# Altium schematic sheet 21.SchDoc
size 513 x 386 mm
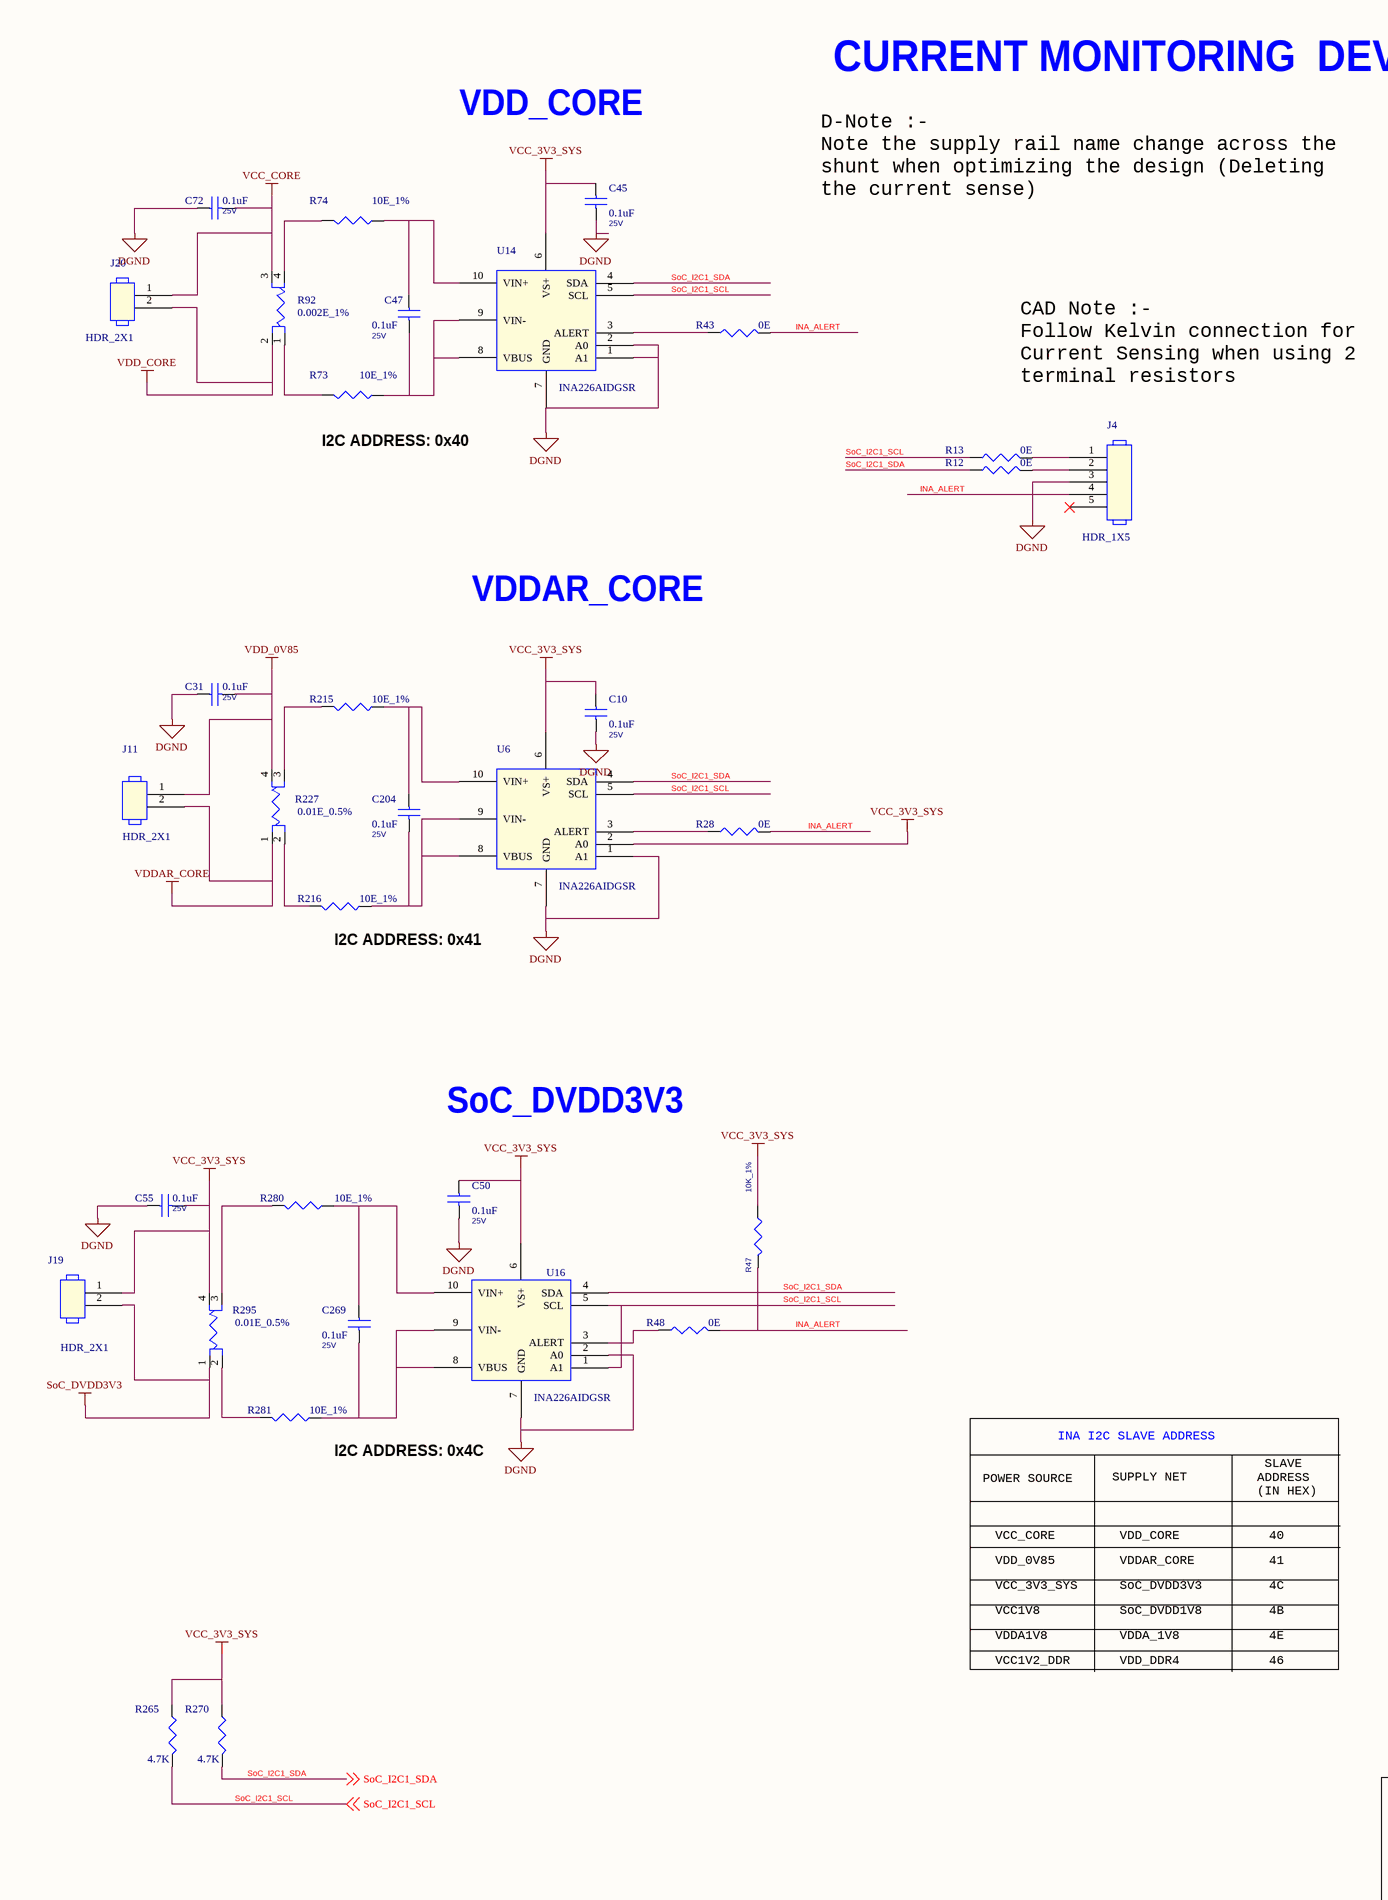
[diagram p0: 21.SchDoc, left]
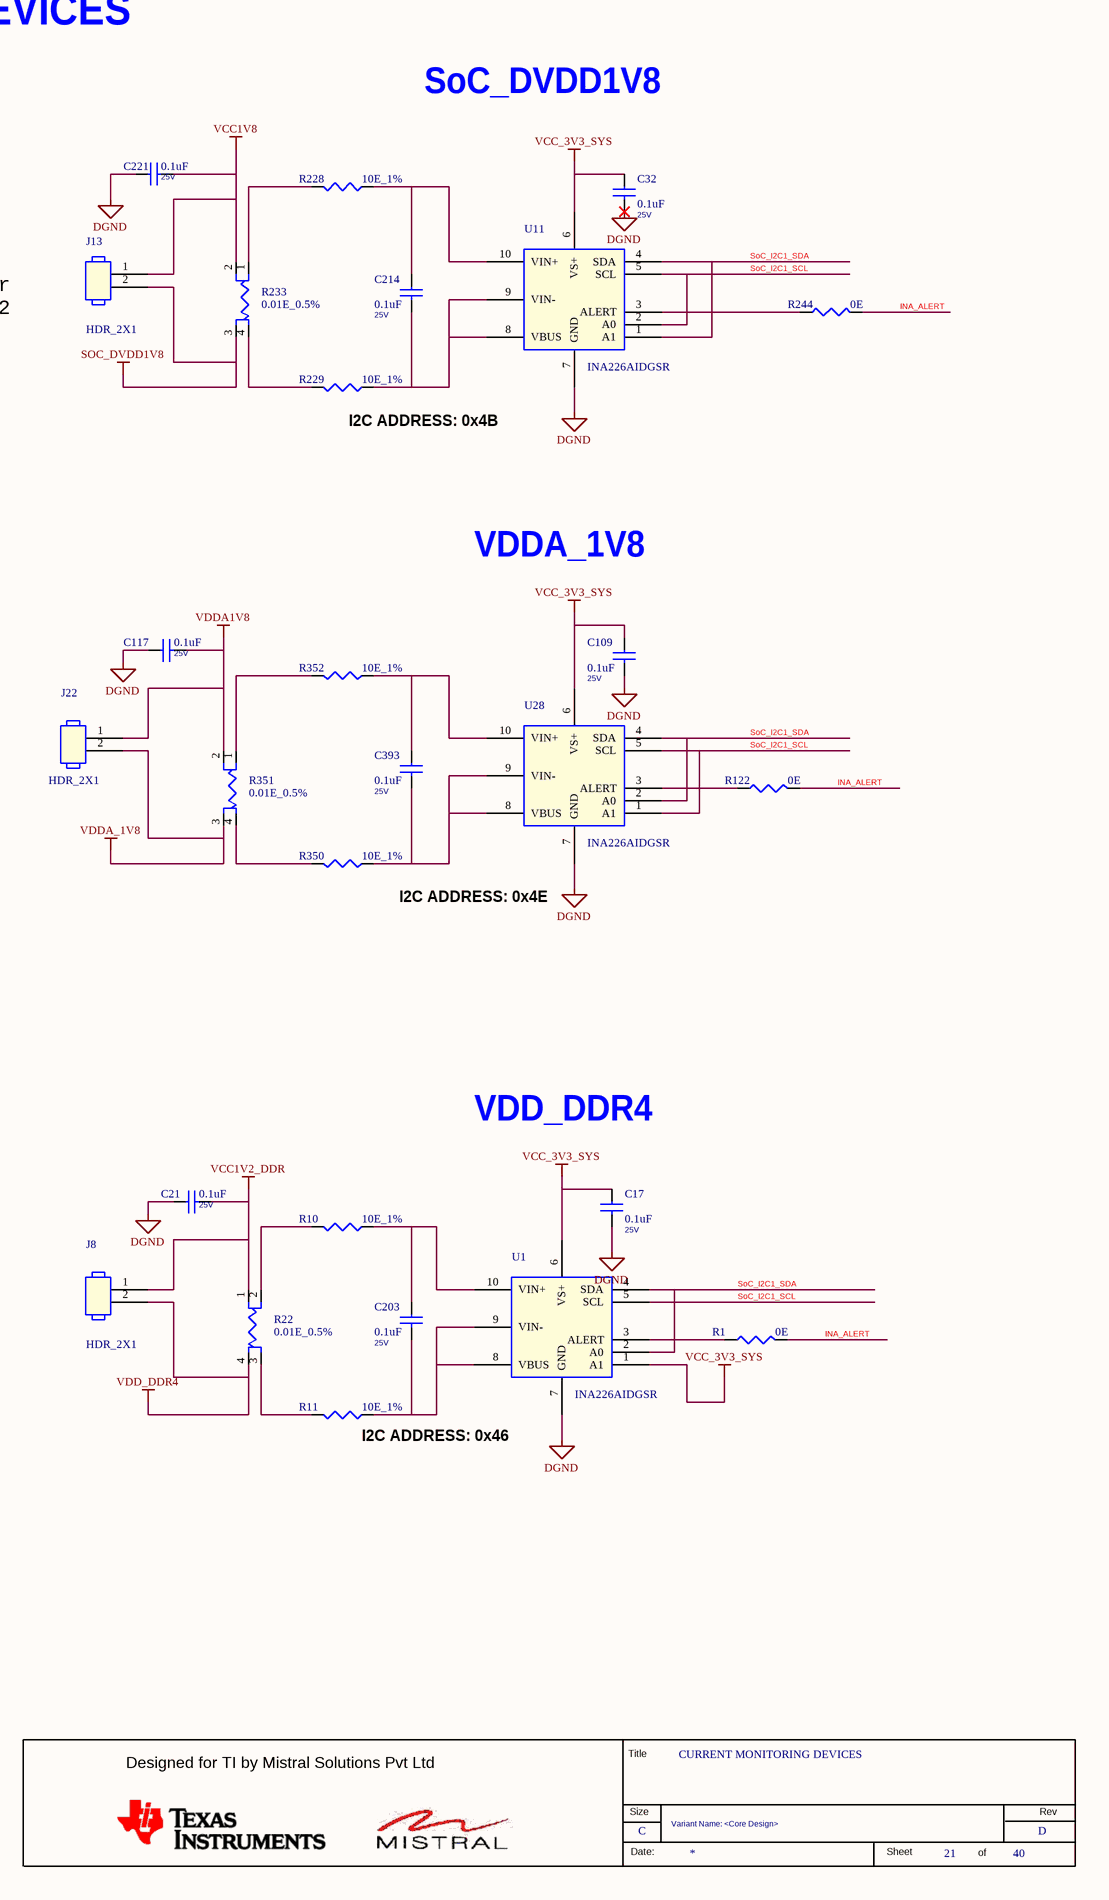
[diagram p1: 21.SchDoc, right]

## Parts
*  RevCode: D  Title: CURRENT MONITORING DEVICES  Page Size: C  Page Number: 21  Page Count: 40  Variant Name: <Core Design>  (hidden comment: MISTRAL_TITLEBLK_CSIZE)  (graphical)
C10  0.1uF  Voltage: 25V  [CAP0402_0-75]
C17  0.1uF  Voltage: 25V  [CAP0402_0-75]
C21  0.1uF  Voltage: 25V  [CAP0402_0-75]
C31  0.1uF  Voltage: 25V  [CAP0402_0-75]
C32  0.1uF  Voltage: 25V  [CAP0402_0-75]
C45  0.1uF  Voltage: 25V  [CAP0402_0-75]
C47  0.1uF  Voltage: 25V  [CAP0402_0-75]
C50  0.1uF  Voltage: 25V  [CAP0402_0-75]
C55  0.1uF  Voltage: 25V  [CAP0402_0-75]
C72  0.1uF  Voltage: 25V  [CAP0402_0-75]
C109  0.1uF  Voltage: 25V  [CAP0402_0-75]
C117  0.1uF  Voltage: 25V  [CAP0402_0-75]
C203  0.1uF  Voltage: 25V  [CAP0402_0-75]
C204  0.1uF  Voltage: 25V  [CAP0402_0-75]
C214  0.1uF  Voltage: 25V  [CAP0402_0-75]
C221  0.1uF  Voltage: 25V  [CAP0402_0-75]
C269  0.1uF  Voltage: 25V  [CAP0402_0-75]
C393  0.1uF  Voltage: 25V  [CAP0402_0-75]
J4  HDR_1X5  [HDR_5X1_100_S_T_11-2]
J8  HDR_2X1  [HDR_2X1_100_S_T_10-8]
J11  HDR_2X1  [HDR_2X1_100_S_T_10-8]
J13  HDR_2X1  [HDR_2X1_100_S_T_10-8]
J19  HDR_2X1  [HDR_2X1_100_S_T_10-8]
J20  HDR_2X1  [HDR_2X1_100_S_T_10-8]
J22  HDR_2X1  [HDR_2X1_100_S_T_10-8]
R1  0E  [RES0402_0-5]
R10  10E_1%  [RES0402_0-5]
R11  10E_1%  [RES0402_0-5]
R12  0E  [RES0402_0-5]
R13  0E  [RES0402_0-5]
R22  0.01E_0.5%  [RES1206-4TERM_0-75]
R28  0E  [RES0402_0-5]
R43  0E  [RES0402_0-5]
R47  10K_1%  [RES0402N]
R48  0E  [RES0402_0-5]
R73  10E_1%  [RES0402_0-5]
R74  10E_1%  [RES0402_0-5]
R92  0.002E_1%  [RES2512-4TERM_0-75]
R122  0E  [RES0402_0-5]
R215  10E_1%  [RES0402_0-5]
R216  10E_1%  [RES0402_0-5]
R227  0.01E_0.5%  [RES1206-4TERM_0-75]
R228  10E_1%  [RES0402_0-5]
R229  10E_1%  [RES0402_0-5]
R233  0.01E_0.5%  [RES1206-4TERM_0-75]
R244  0E  [RES0402_0-5]
R265  4.7K  [RES0402_0-5]
R270  4.7K  [RES0402_0-5]
R280  10E_1%  [RES0402_0-5]
R281  10E_1%  [RES0402_0-5]
R295  0.01E_0.5%  [RES1206-4TERM_0-75]
R350  10E_1%  [RES0402_0-5]
R351  0.01E_0.5%  [RES1206-4TERM_0-75]
R352  10E_1%  [RES0402_0-5]
U1  INA226AIDGSR  [MSOP10_19-68_120X120_1-1]
U6  INA226AIDGSR  [MSOP10_19-68_120X120_1-1]
U11  INA226AIDGSR  [MSOP10_19-68_120X120_1-1]
U14  INA226AIDGSR  [MSOP10_19-68_120X120_1-1]
U16  INA226AIDGSR  [MSOP10_19-68_120X120_1-1]
U28  INA226AIDGSR  [MSOP10_19-68_120X120_1-1]

## Nets
DGND: C10.2 C17.2 C21.1 C31.1 C32.2 C45.2 C50.2 C55.1 C72.1 C109.2 C117.1 C221.1 J4.3 U1.7(GND) U6.1(A1) U6.7(GND) U11.7(GND) U14.1(A1) U14.2(A0) U14.7(GND) U16.2(A0) U16.7(GND) U28.7(GND)
SOC_DVDD1V8: J13.2 R233.3
SoC_DVDD3V3: J19.2 R295.1
VCC1V2_DDR: C21.2 J8.1 R22.1
VCC1V8: C221.2 J13.1 R233.2
VCC_3V3_SYS: C10.1 C17.1 C32.1 C45.1 C50.1 C55.2 C109.1 J19.1 R47.2 R265.1 R270.1 R295.4 U1.1(A1) U1.6(VS+) U6.2(A0) U6.6(VS+) U11.6(VS+) U14.6(VS+) U16.6(VS+) U28.6(VS+)
VCC_CORE: C72.2 J20.1 R92.3
VDD_0V85: C31.2 J11.1 R227.4
VDD_CORE: J20.2 R92.2
VDD_DDR4: J8.2 R22.4
VDDA1V8: C117.2 J22.1 R351.2
VDDA_1V8: J22.2 R351.3
VDDAR_CORE: J11.2 R227.1
INA_ALERT: J4.4 R1.2 R28.2 R43.2 R47.1 R48.2 R122.2 R244.2
SoC_I2C1_SCL: R13.1 R265.2 U1.5(SCL) U6.5(SCL) U11.2(A0) U11.5(SCL) U14.5(SCL) U16.1(A1) U16.5(SCL) U28.1(A1) U28.5(SCL) ; off-sheet SoC_I2C1_SCL
SoC_I2C1_SDA: R12.1 R270.2 U1.2(A0) U1.4(SDA) U6.4(SDA) U11.1(A1) U11.4(SDA) U14.4(SDA) U16.4(SDA) U28.2(A0) U28.4(SDA) ; off-sheet SoC_I2C1_SDA
NetC47_1: C47.1 R74.1 U14.10(VIN+)
NetC47_2: C47.2 R73.1 U14.8(VBUS) U14.9(VIN-)
NetC203_1: C203.1 R10.1 U1.10(VIN+)
NetC203_2: C203.2 R11.1 U1.8(VBUS) U1.9(VIN-)
NetC204_1: C204.1 R215.1 U6.10(VIN+)
NetC204_2: C204.2 R216.1 U6.8(VBUS) U6.9(VIN-)
NetC214_1: C214.1 R228.1 U11.10(VIN+)
NetC214_2: C214.2 R229.1 U11.8(VBUS) U11.9(VIN-)
NetC269_1: C269.1 R280.1 U16.10(VIN+)
NetC269_2: C269.2 R281.1 U16.8(VBUS) U16.9(VIN-)
NetC393_1: C393.1 R352.1 U28.10(VIN+)
NetC393_2: C393.2 R350.1 U28.8(VBUS) U28.9(VIN-)
NetJ4_1: J4.1 R13.2
NetJ4_2: J4.2 R12.2
NetR1_1: R1.1 U1.3(ALERT)
NetR10_2: R10.2 R22.2
NetR11_2: R11.2 R22.3
NetR28_1: R28.1 U6.3(ALERT)
NetR43_1: R43.1 U14.3(ALERT)
NetR48_1: R48.1 U16.3(ALERT)
NetR73_2: R73.2 R92.1
NetR74_2: R74.2 R92.4
NetR122_1: R122.1 U28.3(ALERT)
NetR215_2: R215.2 R227.3
NetR216_2: R216.2 R227.2
NetR228_2: R228.2 R233.1
NetR229_2: R229.2 R233.4
NetR244_1: R244.1 U11.3(ALERT)
NetR280_2: R280.2 R295.3
NetR281_2: R281.2 R295.2
NetR350_2: R350.2 R351.4
NetR351_1: R351.1 R352.2

Not connected (* = marked no-connect by the designer): J4 5*

## Notes on the sheet
- VDD_CORE
- D-Note :-
  Note the supply rail name change across the
  shunt when optimizing the design (Deleting
  the current sense)
- CURRENT MONITORING  DEVICES
- SoC_DVDD1V8
- CAD Note :-
  Follow Kelvin connection for
  Current Sensing when using 2
  terminal resistors
- (near R73) I2C ADDRESS: 0x40
- (near R229) I2C ADDRESS: 0x4B
- VDDAR_CORE
- VDDA_1V8
- (near R216) I2C ADDRESS: 0x41
- I2C ADDRESS: 0x4E
- SoC_DVDD3V3
- VDD_DDR4
- INA I2C SLAVE ADDRESS
- (near R281) I2C ADDRESS: 0x4C
- POWER SOURCE
- SUPPLY NET
- SLAVE
  ADDRESS
  (IN HEX)
- (near R11) I2C ADDRESS: 0x46
- VCC_CORE
- VDD_0V85
- 40
- 41
- VCC_3V3_SYS
- VCC1V8
- 4C
- 4B
- VDDA1V8
- VCC1V2_DDR
- 4E
- 46
- (in symbol MISTRAL_TITLEBLK_CSIZE) Title; Designed for TI by Mistral Solutions Pvt Ltd; Size; Rev; Date:; Sheet; of

## Library data of the parts
* = MISTRAL_TITLEBLK_CSIZE: Issue: 1.0; Page Create Date: March  8, 1995; Page Modify Date: *
C10 C17 C21 C31 C55 C72 C117 C203 C204 C269 C393 = CAP_Dup3: CAP CERAMIC 0.1uF 25V 20% X5R 0402; Alt_Mfr_name: YAGEO AMERICA; Part_type: CAPACITORS\CERAMIC; Mfr_part_number: 885012105018; Mfr_name: WURTH ELECTRONICS; Mistral Part No: 120020080003-R; Alt_Mfr_part_number: CC0402KRX5R8BB104; Custom_Duty: 15%; Customs_HS_Code: 85322990; Wattage: NA; Project: AM64x_EVM_BRD; PCB Footprint: CAP0402_0-75; Footprint Path: Y:\MIS_DATABASE\Library\ALTIUM_TOOL\PCB_FOOTPRINTS\Altium_Footprint_Lib.PcbLib; Library Path: Y:\MIS_DATABASE\Library\ALTIUM_TOOL\SCHEMATICS_PARTS\MS_DISCRETE_Library.schlib; Footprint Ref: CAP0402_0-75; Library Ref: CAP; MECHANICAL 3D STEP FILE: CAP0402_0-75; Chkd/date: MANIRAJA/170820; Crtd /date: ALVY/170820; Datasheet: Y:\MIS_DATABASE\DATASHEETS\CAPACITORS\885012105018.PDF; Temperature: -55癈+85癈; Weight: 0.65mg; Height: 0.55MM; Distributor_part_number: 732-7495-1-ND; Distributor_name: DIGIKEY; Package: 0402; Tolerance: 20%
C32 C45 C47 C50 C109 C214 C221 = CAP_Dup3: CAP CERAMIC 0.1uF 25V 20% X5R 0402; Alt_Mfr_part_number: CC0402KRX5R8BB104; Mistral Part No: 120020080003-R; Mfr_name: WURTH ELECTRONICS; Mfr_part_number: 885012105018; Part_type: CAPACITORS\CERAMIC; Alt_Mfr_name: YAGEO AMERICA; Project: AM64x_EVM_BRD; Wattage: NA; Customs_HS_Code: 85322990; Custom_Duty: 15%; PCB Footprint: CAP0402_0-75; Tolerance: 20%; Package: 0402; Distributor_name: DIGIKEY; Distributor_part_number: 732-7495-1-ND; Height: 0.55MM; Weight: 0.65mg; Temperature: -55癈+85癈; Datasheet: Y:\MIS_DATABASE\DATASHEETS\CAPACITORS\885012105018.PDF; Crtd /date: ALVY/170820; Chkd/date: MANIRAJA/170820; MECHANICAL 3D STEP FILE: CAP0402_0-75; Library Ref: CAP; Footprint Ref: CAP0402_0-75; Library Path: Y:\MIS_DATABASE\Library\ALTIUM_TOOL\SCHEMATICS_PARTS\MS_DISCRETE_Library.schlib; Footprint Path: Y:\MIS_DATABASE\Library\ALTIUM_TOOL\PCB_FOOTPRINTS\Altium_Footprint_Lib.PcbLib
J4 = HEADER_5X1: CON HDR 1X5 2.54MM PITCH ST TH; Mistral Part No: 150009030262-R; Mfr_name: MOLEX; Part_type: CONNECTOR\HEADERS; Wattage: NA; Project: HSWD; Customs_HS_Code: 85369090; Custom_Duty: 24%; MECHANICAL 3D STEP FILE: HDR_5X1_100_S_T_11-2; Temperature: NA; Weight: 343mg; Voltage: NA; Tolerance: NA; Mfr_part_number: 22-03-2051; Package: THRU-HOLE; Distributor_name: DIGIKEY; Distributor_part_number: WM4003-ND; Height: 11.17MM; Datasheet: Y:\MIS_DATABASE\DATASHEETS\CONNECTORS\MOLEX022032021.PDF; Crtd /date: MAZHAR/280405; Chkd/date: VASANTHA/310117; Library Ref: HEADER_5X1; Library Path: Y:\MIS_DATABASE\Library\ALTIUM_TOOL\SCHEMATICS_PARTS\MS_CONNECTOR_Library.schlib; Footprint Path: Y:\MIS_DATABASE\Library\ALTIUM_TOOL\PCB_FOOTPRINTS\Altium_Footprint_Lib.PcbLib; PCB Footprint: HDR_5X1_100_S_T_11-2
J8 J11 J13 J19 J20 J22 = HEADER_2X1_Dup1: CON HDR 2X1 2.54MM PITCH ST TH; Mistral Part No: 150009030246-R; Mfr_name: MOLEX; Part_type: CONNECTOR\HEADERS; Wattage: NA; Project: FPGA EXTENDER CARD; Customs_HS_Code: 85369090; Custom_Duty: 24%; Footprint Path: Y:\MIS_DATABASE\Library\ALTIUM_TOOL\PCB_FOOTPRINTS\Altium_Footprint_Lib.PcbLib; Library Path: Y:\MIS_DATABASE\Library\ALTIUM_TOOL\SCHEMATICS_PARTS\MS_Connector_Library.schlib; MECHANICAL 3D STEP FILE: HDR_2X1_100_S_T_10-8; Temperature: -0癈+75癈; Weight: 139gm; Voltage: NA; Tolerance: NA; Mfr_part_number: 22-03-2021; Package: THRU-HOLE; Distributor_name: DIGIKEY; Distributor_part_number: WM4000-ND; Height: 10.79MM; Datasheet: Y:\MIS_DATABASE\DATASHEETS\CONNECTORS\HEADER_X4030.PDF; Crtd /date: MAZHAR/280405; Chkd/date: VASANTHA/060117; Library Ref: HEADER_2X1; Footprint Ref: HDR_2X1_100_S_T_10-8; PCB Footprint: HDR_2X1_100_S_T_10-8
R1 R12 R28 R43 R244 = RESISTOR_Dup5: RES 0E 1/16W JUMPER 0402; Part_type: RESISTORS\FIXED; Mfr_part_number: CRCW04020000Z0ED; Mfr_name: VISHAY; Mistral Part No: 110010080019-R; Custom_Duty: 15%; Customs_HS_Code: 85332119; Voltage: NA; Project: PB_BUGBASE; Footprint Path: Y:\MIS_DATABASE\Library\ALTIUM_TOOL\PCB_FOOTPRINTS\Altium_Footprint_Lib.PcbLib; Library Path: Y:\MIS_DATABASE\Library\ALTIUM_TOOL\SCHEMATICS_PARTS\MS_DISCRETE_Library.schlib; Footprint Ref: RES0402_0-5; Library Ref: RESISTOR; Chkd/date: VASANTHA/201216; Crtd /date: MUDDU/190810; Datasheet: Y:\MIS_DATABASE\DATASHEETS\RESISTORS\CRCW0603.PDF; Temperature: -55癈+155癈; Weight: 0.65mg; Height: 0.40MM; Distributor_part_number: 541-0.0JCT-ND; Distributor_name: DIGIKEY; Package: 0402; Wattage: 1/16W; Tolerance: NA; MECHANICAL 3D STEP FILE: RES0402_0-5; PCB Footprint: RES0402_0-5
R10 R11 R73 R216 R281 R350 R352 = RESISTOR_Dup6: RES 10E 1/16W 1% 0402; Part_type: RESISTORS\FIXED; Mfr_part_number: RC0402FR-0710RL; Mfr_name: YAGEO AMERICA; Mistral Part No: 110018020004-R; Custom_Duty: 15%; Customs_HS_Code: 85332119; Voltage: NA; Project: TI_MAXIE_CPB; MECHANICAL 3D STEP FILE: RES0402_0-5; Chkd/date: MANIRAJA/070218; Crtd /date: ALVY/070218; Datasheet: Y:\MIS_DATABASE\DATASHEETS\RESISTORS\RCXXXXL-SER_MAR18.PDF; Temperature: -55癈+155癈; Weight: 0.65mg; Height: 0.40MM; Distributor_part_number: 311-10.0LRCT-ND; Distributor_name: DIGIKEY; Package: 0402; Wattage: 1/16W; Tolerance: 1%; Library Ref: RESISTOR; Footprint Ref: RES0402_0-5; Library Path: Y:\MIS_DATABASE\Library\ALTIUM_TOOL\SCHEMATICS_PARTS\MS_DISCRETE_Library.schlib; Footprint Path: Y:\MIS_DATABASE\Library\ALTIUM_TOOL\PCB_FOOTPRINTS\Altium_Footprint_Lib.PcbLib; PCB Footprint: RES0402_0-5
R13 R48 R122 = RESISTOR_Dup5: RES 0E 1/16W JUMPER 0402; Mistral Part No: 110010080019-R; Mfr_name: VISHAY; Mfr_part_number: CRCW04020000Z0ED; Part_type: RESISTORS\FIXED; Project: PB_BUGBASE; Tolerance: NA; Customs_HS_Code: 85332119; Custom_Duty: 15%; MECHANICAL 3D STEP FILE: RES0402_0-5; Voltage: NA; Wattage: 1/16W; Package: 0402; Distributor_name: DIGIKEY; Distributor_part_number: 541-0.0JCT-ND; Height: 0.40MM; Weight: 0.65mg; Temperature: -55癈+155癈; Datasheet: Y:\MIS_DATABASE\DATASHEETS\RESISTORS\CRCW0603.PDF; Crtd /date: MUDDU/190810; Chkd/date: VASANTHA/201216; Library Ref: RESISTOR; Footprint Ref: RES0402_0-5; Library Path: Y:\MIS_DATABASE\Library\ALTIUM_TOOL\SCHEMATICS_PARTS\MS_DISCRETE_Library.schlib; Footprint Path: Y:\MIS_DATABASE\Library\ALTIUM_TOOL\PCB_FOOTPRINTS\Altium_Footprint_Lib.PcbLib; PCB Footprint: RES0402_0-5
R22 R233 R351 = RESISTOR-4TERM: RES 0.01E 1/2W 0.5% 1206-4; Part_type: RESISTORS\FIXED; Mfr_part_number: LVK12R010DER; Mfr_name: OHMITE; Mistral Part No: 110017090009-R; Custom_Duty: 15%; Customs_HS_Code: 85332119; Voltage: NA; Project: TI_MAXIE_CPB; PCB Footprint: RES1206-4TERM_0-75; Footprint Path: Y:\MIS_DATABASE\Library\ALTIUM_TOOL\PCB_FOOTPRINTS\Altium_Footprint_Lib.PcbLib; Library Path: Y:\MIS_DATABASE\Library\ALTIUM_TOOL\SCHEMATICS_PARTS\MS_DISCRETE_Library.schlib; Footprint Ref: RES1206-4TERM_0-75; Library Ref: RESISTOR-4TERM; MECHANICAL 3D STEP FILE: RES1206-4TERM_0-75; Chkd/date: MANIRAJA/260917; Crtd /date: MANIRAJA/260917; Datasheet: Y:\MIS_DATABASE\DATASHEETS\RESISTORS\LVK-SERIES.PDF; Temperature: -40癈+125癈; Weight: 16.2mg; Height: 0.65MM; Distributor_part_number: LVK12R010DERCT-ND; Distributor_name: DIGIKEY; Package: 1206-4; Wattage: 1/2W; Tolerance: 0.5%
R47 = RESISTOR_Dup3: RES 10K 1/16W 1% 0402; Part_type: RESISTORS\FIXED; Mfr_part_number: RC0402FR-0710KL; Mfr_name: YAGEO AMERICA; Mistral Part No: 110015090015-R; MECHANICAL 3D STEP FILE: RES0402_0-5; Voltage: NA; Custom_Duty: 15%; Customs_HS_Code: 85332119; Project: VOCERA; Footprint Path: Y:\MIS_DATABASE\Library\ALTIUM_TOOL\PCB_FOOTPRINTS\Altium_Footprint_Lib.PcbLib; Library Path: Y:\MIS_DATABASE\Library\ALTIUM_TOOL\SCHEMATICS_PARTS\MS_DISCRETE_Library.schlib; Footprint Ref: RES0402_0-5; Library Ref: RESISTOR; Temperature: -55癈+155癈; Weight: 0.65mg; Chkd/date: VASANTHA/201216; Crtd /date: GEETHA/290506; Datasheet: Y:\MIS_DATABASE\DATASHEETS\RESISTORS\RCXXXXL-SER_MAR18.PDF; Height: 0.40MM; Distributor_part_number: 311-10.0KLRTR-ND; Distributor_name: DIGIKEY; Package: 0402; Wattage: 1/16W; Tolerance: 1%; PCB Footprint: RES0402_0-5
R74 R215 R228 R229 R280 = RESISTOR_Dup6: RES 10E 1/16W 1% 0402; Mistral Part No: 110018020004-R; Mfr_name: YAGEO AMERICA; Mfr_part_number: RC0402FR-0710RL; Part_type: RESISTORS\FIXED; Project: TI_MAXIE_CPB; Voltage: NA; Customs_HS_Code: 85332119; Custom_Duty: 15%; Tolerance: 1%; Wattage: 1/16W; Package: 0402; Distributor_name: DIGIKEY; Distributor_part_number: 311-10.0LRCT-ND; Height: 0.40MM; Weight: 0.65mg; Temperature: -55癈+155癈; Datasheet: Y:\MIS_DATABASE\DATASHEETS\RESISTORS\RCXXXXL-SER_MAR18.PDF; Crtd /date: ALVY/070218; Chkd/date: MANIRAJA/070218; MECHANICAL 3D STEP FILE: RES0402_0-5; Library Ref: RESISTOR; Footprint Ref: RES0402_0-5; Library Path: Y:\MIS_DATABASE\Library\ALTIUM_TOOL\SCHEMATICS_PARTS\MS_DISCRETE_Library.schlib; Footprint Path: Y:\MIS_DATABASE\Library\ALTIUM_TOOL\PCB_FOOTPRINTS\Altium_Footprint_Lib.PcbLib; PCB Footprint: RES0402_0-5
R92 = RESISTOR-4TERM: RES 0.002E 2W 1% 2512-4; Mistral Part No: 110017090010-R; Mfr_name: OHMITE; Mfr_part_number: LVK25R002FER; Part_type: RESISTORS\FIXED; Project: TI_MAXIE_CPB; Voltage: NA; Customs_HS_Code: 85332119; Custom_Duty: 15%; PCB Footprint: RES2512-4TERM_0-75; Tolerance: 1%; Wattage: 2W; Package: 2512-4; Distributor_name: DIGIKEY; Distributor_part_number: LVK25R002FERCT-ND; Height: 0.70MM; Weight: NA; Temperature: -40癈+125癈; Datasheet: Y:\MIS_DATABASE\DATASHEETS\RESISTORS\LVK-SERIES.PDF; Crtd /date: MANIRAJA/260917; Chkd/date: MANIRAJA/260917; MECHANICAL 3D STEP FILE: RES2512-4TERM_0-75; Library Ref: RESISTOR-4TERM; Footprint Ref: RES2512-4TERM_0-75; Library Path: Y:\MIS_DATABASE\Library\ALTIUM_TOOL\SCHEMATICS_PARTS\MS_DISCRETE_Library.schlib; Footprint Path: Y:\MIS_DATABASE\Library\ALTIUM_TOOL\PCB_FOOTPRINTS\Altium_Footprint_Lib.PcbLib
R227 R295 = RESISTOR-4TERM: RES 0.01E 1/2W 0.5% 1206-4; Mistral Part No: 110017090009-R; Mfr_name: OHMITE; Mfr_part_number: LVK12R010DER; Part_type: RESISTORS\FIXED; Project: TI_MAXIE_CPB; Voltage: NA; Customs_HS_Code: 85332119; Custom_Duty: 15%; PCB Footprint: RES1206-4TERM_0-75; Library Ref: RESISTOR-4TERM; Tolerance: 0.5%; Wattage: 1/2W; Package: 1206-4; Distributor_name: DIGIKEY; Distributor_part_number: LVK12R010DERCT-ND; Height: 0.65MM; Weight: 16.2mg; Temperature: -40癈+125癈; Datasheet: Y:\MIS_DATABASE\DATASHEETS\RESISTORS\LVK-SERIES.PDF; Crtd /date: MANIRAJA/260917; Chkd/date: MANIRAJA/260917; MECHANICAL 3D STEP FILE: RES1206-4TERM_0-75; Footprint Ref: RES1206-4TERM_0-75; Library Path: Y:\MIS_DATABASE\Library\ALTIUM_TOOL\SCHEMATICS_PARTS\MS_DISCRETE_Library.schlib; Footprint Path: Y:\MIS_DATABASE\Library\ALTIUM_TOOL\PCB_FOOTPRINTS\Altium_Footprint_Lib.PcbLib
R265 = RESISTOR_Dup4: RES 4.7K 1/16W 5% 0402; Mistral Part No: 110011060001-R; Mfr_name: YAGEO AMERICA; Mfr_part_number: RC0402JR-074K7L; Part_type: RESISTORS\FIXED; Project: TMDXCSK368; Voltage: NA; Customs_HS_Code: 85332119; Custom_Duty: 15%; PCB Footprint: RES0402_0-5; Library Ref: RESISTOR; Tolerance: 5%; Wattage: 1/16W; Package: 0402; Distributor_name: DIGIKEY; Distributor_part_number: 311-4.7KJRCT-ND; Height: 0.40MM; Weight: 0.65mg; Temperature: -55癈+155癈; Datasheet: Y:\MIS_DATABASE\DATASHEETS\RESISTORS\RCXXXXL-SER_MAR18.PDF; Crtd /date: VASANTHA/130516; Chkd/date: VASANTHA/130516; Footprint Ref: RES0402_0-5; MECHANICAL 3D STEP FILE: RES0402_0-5; Library Path: Y:\MIS_DATABASE\Library\ALTIUM_TOOL\SCHEMATICS_PARTS\MS_DISCRETE_Library.schlib; Footprint Path: Y:\MIS_DATABASE\Library\ALTIUM_TOOL\PCB_FOOTPRINTS\Altium_Footprint_Lib.PcbLib
R270 = RESISTOR_Dup4: RES 4.7K 1/16W 5% 0402; Part_type: RESISTORS\FIXED; Mfr_part_number: RC0402JR-074K7L; Mfr_name: YAGEO AMERICA; Mistral Part No: 110011060001-R; Custom_Duty: 15%; Customs_HS_Code: 85332119; Voltage: NA; Project: TMDXCSK368; PCB Footprint: RES0402_0-5; Footprint Path: Y:\MIS_DATABASE\Library\ALTIUM_TOOL\PCB_FOOTPRINTS\Altium_Footprint_Lib.PcbLib; Library Path: Y:\MIS_DATABASE\Library\ALTIUM_TOOL\SCHEMATICS_PARTS\MS_DISCRETE_Library.schlib; MECHANICAL 3D STEP FILE: RES0402_0-5; Footprint Ref: RES0402_0-5; Chkd/date: VASANTHA/130516; Crtd /date: VASANTHA/130516; Datasheet: Y:\MIS_DATABASE\DATASHEETS\RESISTORS\RCXXXXL-SER_MAR18.PDF; Temperature: -55癈+155癈; Weight: 0.65mg; Height: 0.40MM; Distributor_part_number: 311-4.7KJRCT-ND; Distributor_name: DIGIKEY; Package: 0402; Wattage: 1/16W; Tolerance: 5%; Library Ref: RESISTOR
U1 U6 U11 U14 U16 U28 = INA226AIDGS_MSOP10: IC BI-DIRECTIONAL CURRENT MONITER MSOP10; Mistral Part No: 141011080019-R; Mfr_name: TEXAS INSTRUMENTS; Part_type: ICS\INTERFACE; Project: DM385EVM_BASE-BOARD; Tolerance: NA; Customs_HS_Code: 85423100; Custom_Duty: 15%; Chkd/date: MANIRAJA/050417; Mfr_part_number: INA226AIDGSR; Voltage: NA; Wattage: NA; Package: MSOP10; Distributor_name: DIGIKEY; Distributor_part_number: 296-29034-1-ND; Height: 1.10MM; Weight: NA; Temperature: -40癈+125癈; Datasheet: Y:\MIS_DATABASE\DATASHEETS\ICS\INTERFACE\INA226.PDF; Crtd /date: MANIRAJA/050417; MECHANICAL 3D STEP FILE: MSOP10_19-68_120X120_1-1; Library Ref: INA226AIDGS_MSOP10; Footprint Ref: MSOP10_19-68_120X120_1-1; Library Path: Y:\MIS_DATABASE\Library\ALTIUM_TOOL\SCHEMATICS_PARTS\MS_MISCINTERFACE_Library.schlib; Footprint Path: Y:\MIS_DATABASE\Library\ALTIUM_TOOL\PCB_FOOTPRINTS\Altium_Footprint_Lib.PcbLib; PCB Footprint: MSOP10_19-68_120X120_1-1